# Altium schematic sheet 03 pmic.SchDoc
size A3; SheetNumber: 4; SheetTotal: 16
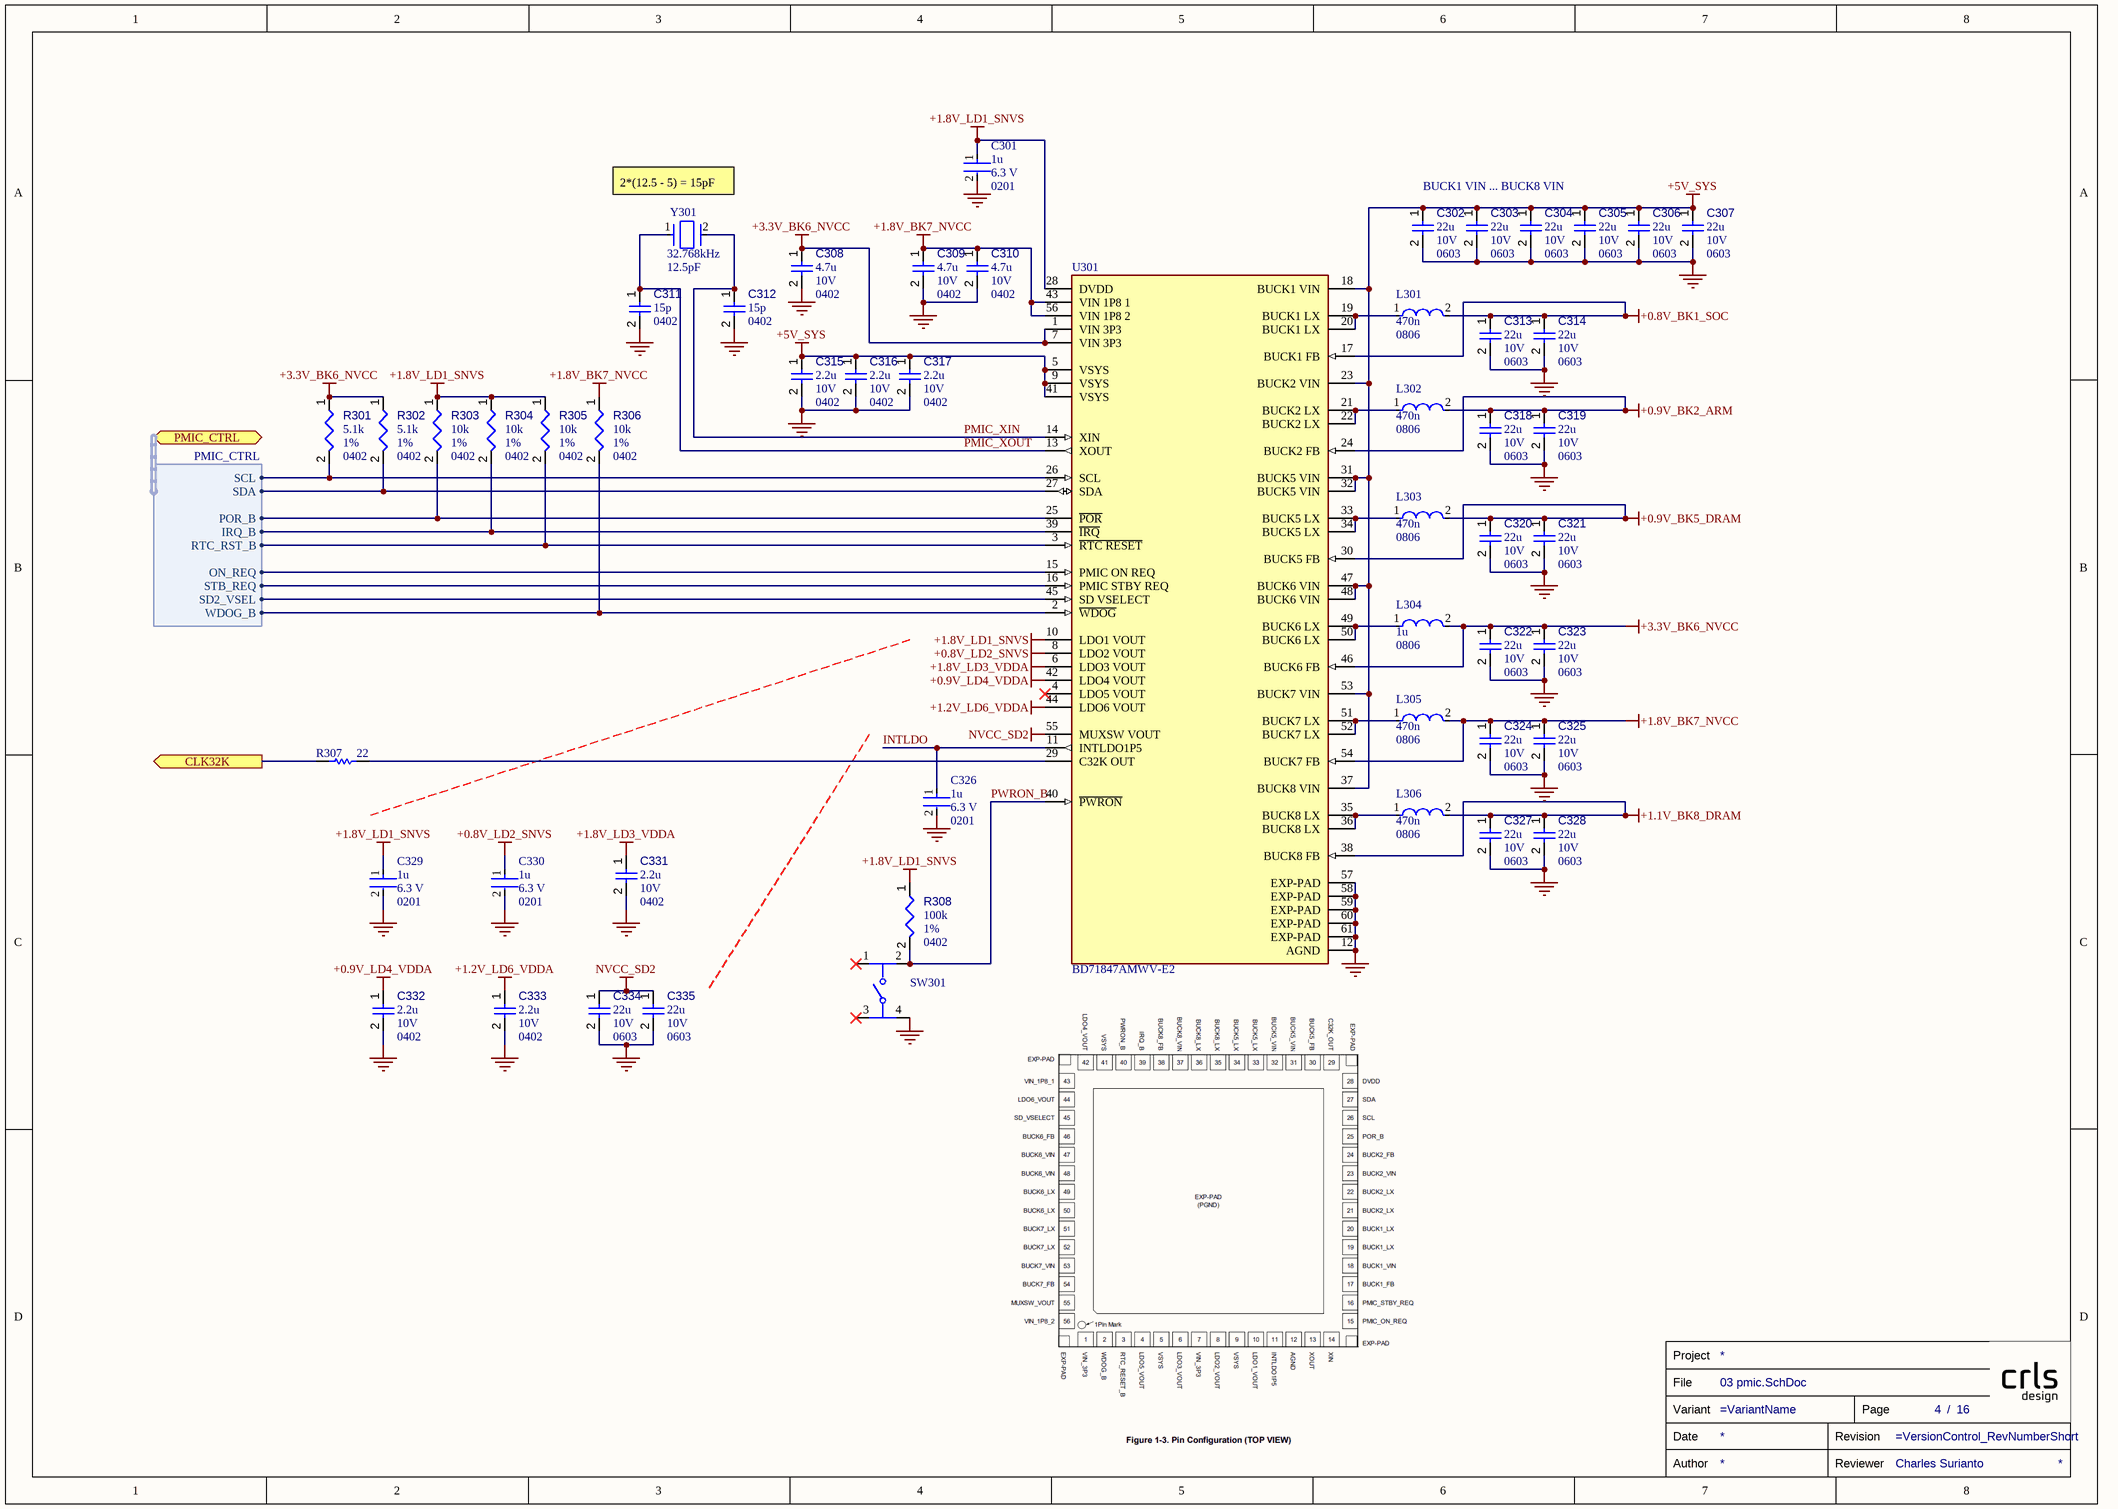
[diagram p0: 03 pmic.SchDoc]

## Parts
C301  Package: 0201  Capacitance: 1u  Voltage Rating: 6.3 V  [FP-CC0201-BA-MFG]  (hidden comment: CC0201MRX5R5BB105)
C302  value 22u  Case/Package: 0603  Voltage Rating: 10V  [CAPC0603(1608)100_L]  (hidden comment: Capacitors,0603,22u,10V)
C303  value 22u  Case/Package: 0603  Voltage Rating: 10V  [CAPC0603(1608)100_L]  (hidden comment: Capacitors,0603,22u,10V)
C304  value 22u  Case/Package: 0603  Voltage Rating: 10V  [CAPC0603(1608)100_L]  (hidden comment: Capacitors,0603,22u,10V)
C305  value 22u  Case/Package: 0603  Voltage Rating: 10V  [CAPC0603(1608)100_L]  (hidden comment: Capacitors,0603,22u,10V)
C306  value 22u  Case/Package: 0603  Voltage Rating: 10V  [CAPC0603(1608)100_L]  (hidden comment: Capacitors,0603,22u,10V)
C307  value 22u  Case/Package: 0603  Voltage Rating: 10V  [CAPC0603(1608)100_L]  (hidden comment: Capacitors,0603,22u,10V)
C308  value 4.7u  Case/Package: 0402  Voltage Rating: 10V  [CAPC0402(1005)60_L]  (hidden comment: Capacitors,0402,4.7u,10V)
C309  value 4.7u  Case/Package: 0402  Voltage Rating: 10V  [CAPC0402(1005)60_L]  (hidden comment: Capacitors,0402,4.7u,10V)
C310  value 4.7u  Case/Package: 0402  Voltage Rating: 10V  [CAPC0402(1005)60_L]  (hidden comment: Capacitors,0402,4.7u,10V)
C311  value 15p  Case/Package: 0402  [CAPC0402(1005)60_L]  (hidden comment: Capacitors,0402,15p)
C312  value 15p  Case/Package: 0402  [CAPC0402(1005)60_L]  (hidden comment: Capacitors,0402,15p)
C313  value 22u  Case/Package: 0603  Voltage Rating: 10V  [CAPC0603(1608)100_L]  (hidden comment: Capacitors,0603,22u,10V)
C314  value 22u  Case/Package: 0603  Voltage Rating: 10V  [CAPC0603(1608)100_L]  (hidden comment: Capacitors,0603,22u,10V)
C315  value 2.2u  Case/Package: 0402  Voltage Rating: 10V  [CAPC0402(1005)60_L]  (hidden comment: Capacitors,0402,2.2u,10V)
C316  value 2.2u  Case/Package: 0402  Voltage Rating: 10V  [CAPC0402(1005)60_L]  (hidden comment: Capacitors,0402,2.2u,10V)
C317  value 2.2u  Case/Package: 0402  Voltage Rating: 10V  [CAPC0402(1005)60_L]  (hidden comment: Capacitors,0402,2.2u,10V)
C318  value 22u  Case/Package: 0603  Voltage Rating: 10V  [CAPC0603(1608)100_L]  (hidden comment: Capacitors,0603,22u,10V)
C319  value 22u  Case/Package: 0603  Voltage Rating: 10V  [CAPC0603(1608)100_L]  (hidden comment: Capacitors,0603,22u,10V)
C320  value 22u  Case/Package: 0603  Voltage Rating: 10V  [CAPC0603(1608)100_L]  (hidden comment: Capacitors,0603,22u,10V)
C321  value 22u  Case/Package: 0603  Voltage Rating: 10V  [CAPC0603(1608)100_L]  (hidden comment: Capacitors,0603,22u,10V)
C322  value 22u  Case/Package: 0603  Voltage Rating: 10V  [CAPC0603(1608)100_L]  (hidden comment: Capacitors,0603,22u,10V)
C323  value 22u  Case/Package: 0603  Voltage Rating: 10V  [CAPC0603(1608)100_L]  (hidden comment: Capacitors,0603,22u,10V)
C324  value 22u  Case/Package: 0603  Voltage Rating: 10V  [CAPC0603(1608)100_L]  (hidden comment: Capacitors,0603,22u,10V)
C325  value 22u  Case/Package: 0603  Voltage Rating: 10V  [CAPC0603(1608)100_L]  (hidden comment: Capacitors,0603,22u,10V)
C326  Package: 0201  Capacitance: 1u  Voltage Rating: 6.3 V  [FP-CC0201-BA-MFG]  (hidden comment: CC0201MRX5R5BB105)
C327  value 22u  Case/Package: 0603  Voltage Rating: 10V  [CAPC0603(1608)100_L]  (hidden comment: Capacitors,0603,22u,10V)
C328  value 22u  Case/Package: 0603  Voltage Rating: 10V  [CAPC0603(1608)100_L]  (hidden comment: Capacitors,0603,22u,10V)
C329  Package: 0201  Capacitance: 1u  Voltage Rating: 6.3 V  [FP-CC0201-BA-MFG]  (hidden comment: CC0201MRX5R5BB105)
C330  Package: 0201  Capacitance: 1u  Voltage Rating: 6.3 V  [FP-CC0201-BA-MFG]  (hidden comment: CC0201MRX5R5BB105)
C331  value 2.2u  Case/Package: 0402  Voltage Rating: 10V  [CAPC0402(1005)60_L]  (hidden comment: Capacitors,0402,2.2u,10V)
C332  value 2.2u  Case/Package: 0402  Voltage Rating: 10V  [CAPC0402(1005)60_L]  (hidden comment: Capacitors,0402,2.2u,10V)
C333  value 2.2u  Case/Package: 0402  Voltage Rating: 10V  [CAPC0402(1005)60_L]  (hidden comment: Capacitors,0402,2.2u,10V)
C334  value 22u  Case/Package: 0603  Voltage Rating: 10V  [CAPC0603(1608)100_L]  (hidden comment: Capacitors,0603,22u,10V)
C335  value 22u  Case/Package: 0603  Voltage Rating: 10V  [CAPC0603(1608)100_L]  (hidden comment: Capacitors,0603,22u,10V)
L301  value 470n  Package: 0806  [FP-DFE201610C-MFG]  (hidden comment: DFE201610E-R47M=P2)
L302  value 470n  Package: 0806  [FP-DFE201610C-MFG]  (hidden comment: DFE201610E-R47M=P2)
L303  value 470n  Package: 0806  [FP-DFE201610C-MFG]  (hidden comment: DFE201610E-R47M=P2)
L304  value 1u  Package: 0806  [FP-DFE201612C-MFG]  (hidden comment: DFE201612E-1R0M=P2)
L305  value 470n  Package: 0806  [FP-DFE201610C-MFG]  (hidden comment: DFE201610E-R47M=P2)
L306  value 470n  Package: 0806  [FP-DFE201610C-MFG]  (hidden comment: DFE201610E-R47M=P2)
R301  value 5.1k  Case/Package: 0402  Tolerance: 1%  [RESC0402(1005)_L]  (hidden comment: Resistors,0402,1%,5.1k)
R302  value 5.1k  Case/Package: 0402  Tolerance: 1%  [RESC0402(1005)_L]  (hidden comment: Resistors,0402,1%,5.1k)
R303  value 10k  Case/Package: 0402  Tolerance: 1%  [RESC0402(1005)_L]  (hidden comment: Resistors,0402,1%,10k)
R304  value 10k  Case/Package: 0402  Tolerance: 1%  [RESC0402(1005)_L]  (hidden comment: Resistors,0402,1%,10k)
R305  value 10k  Case/Package: 0402  Tolerance: 1%  [RESC0402(1005)_L]  (hidden comment: Resistors,0402,1%,10k)
R306  value 10k  Case/Package: 0402  Tolerance: 1%  [RESC0402(1005)_L]  (hidden comment: Resistors,0402,1%,10k)
R307  value 22  [RESC0201(0603)_L]  (hidden comment: 22R 1% 0201(0603))
R308  value 100k  Case/Package: 0402  Tolerance: 1%  [RESC0402(1005)_L]  (hidden comment: Resistors,0402,1%,100k)
SW301  PTS810SJM250SMTRLFS  [FP-PTS810SJM250SMTRLFS-MFG]  (value not drawn)
TB?  Reviewer: Charles Surianto  (hidden comment: TITLE_BLOCK)  (graphical)
U301  BD71847AMWV-E2  [FP-UQFN56BV7070-MFG]
Y301  Frequency: 32.768kHz  Load Capacitance: 12.5pF  [FP-NX3215SA-MFG]  (hidden comment: Q13FC13500004)

## Ports
CLK32K (out), PMIC_CTRL (bidir, harness PMIC_CTRL)

## Harnesses
PMIC_CTRL: SCL, SDA, IRQ_B, POR_B, RTC_RST_B, ON_REQ, STB_REQ, SD2_VSEL, WDOG_B

## Nets
+0.8V_BK1_SOC: C313.1 C314.1 L301.2 U301.17(BUCK1_FB)
+0.8V_LD2_SNVS: C330.1 U301.8(LDO2_VOUT)
+0.9V_BK2_ARM: C318.1 C319.1 L302.2 U301.24(BUCK2_FB)
+0.9V_BK5_DRAM: C320.1 C321.1 L303.2 U301.30(BUCK5_FB)
+0.9V_LD4_VDDA: C332.1 U301.42(LDO4_VOUT)
+1.1V_BK8_DRAM: C327.1 C328.1 L306.2 U301.38(BUCK8_FB)
+1.2V_LD6_VDDA: C333.1 U301.44(LDO6_VOUT)
+1.8V_BK7_NVCC: C309.1 C310.1 C324.1 C325.1 L305.2 R306.1 U301.43(VIN_1P8_1) U301.54(BUCK7_FB) U301.56(VIN_1P8_2)
+1.8V_LD1_SNVS: C301.1 C329.1 R303.1 R304.1 R305.1 R308.1 U301.10(LDO1_VOUT) U301.28(DVDD)
+1.8V_LD3_VDDA: C331.1 U301.6(LDO3_VOUT)
+3.3V_BK6_NVCC: C308.1 C322.1 C323.1 L304.2 R301.1 R302.1 U301.1(VIN_3P3) U301.7(VIN_3P3) U301.46(BUCK6_FB)
+5V_SYS: C302.1 C303.1 C304.1 C305.1 C306.1 C307.1 C315.1 C316.1 C317.1 U301.5(VSYS) U301.9(VSYS) U301.18(BUCK1_VIN) U301.23(BUCK2_VIN) U301.31(BUCK5_VIN) U301.32(BUCK5_VIN) U301.37(BUCK8_VIN) U301.41(VSYS) U301.47(BUCK6_VIN) U301.48(BUCK6_VIN) U301.53(BUCK7_VIN)
GND: C301.2 C302.2 C303.2 C304.2 C305.2 C306.2 C307.2 C308.2 C309.2 C310.2 C311.2 C312.2 C313.2 C314.2 C315.2 C316.2 C317.2 C318.2 C319.2 C320.2 C321.2 C322.2 C323.2 C324.2 C325.2 C326.2 C327.2 C328.2 C329.2 C330.2 C331.2 C332.2 C333.2 C334.2 C335.2 SW301.4 U301.12(AGND) U301.57(EXP-PAD) U301.58(EXP-PAD) U301.59(EXP-PAD) U301.60(EXP-PAD) U301.61(EXP-PAD)
NVCC_SD2: C334.1 C335.1 U301.55(MUXSW_VOUT)
CLK32K: R307.1 ; port CLK32K
INTLDO: C326.1 U301.11(INTLDO1P5)
PMIC_XIN: C312.1 U301.14(XIN) Y301.2
PMIC_XOUT: C311.1 U301.13(XOUT) Y301.1
PWRON_B: R308.2 SW301.2 U301.40(~{PWRON})
NetL301_1: L301.1 U301.19(BUCK1_LX) U301.20(BUCK1_LX)
NetL302_1: L302.1 U301.21(BUCK2_LX) U301.22(BUCK2_LX)
NetL303_1: L303.1 U301.33(BUCK5_LX) U301.34(BUCK5_LX)
NetL304_1: L304.1 U301.49(BUCK6_LX) U301.50(BUCK6_LX)
NetL305_1: L305.1 U301.51(BUCK7_LX) U301.52(BUCK7_LX)
NetL306_1: L306.1 U301.35(BUCK8_LX) U301.36(BUCK8_LX)
NetR301_2: R301.2 U301.26(SCL) ; port PMIC_CTRL.SCL
NetR302_2: R302.2 U301.27(SDA) ; port PMIC_CTRL.SDA
NetR303_2: R303.2 U301.25(~{POR}) ; port PMIC_CTRL.POR_B
NetR304_2: R304.2 U301.39(~{IRQ}) ; port PMIC_CTRL.IRQ_B
NetR305_2: R305.2 U301.3(~{RTC_RESET}) ; port PMIC_CTRL.RTC_RST_B
NetR306_2: R306.2 U301.2(~{WDOG}) ; port PMIC_CTRL.WDOG_B
NetR307_2: R307.2 U301.29(C32K_OUT)
NetU301_15: U301.15(PMIC_ON_REQ) ; port PMIC_CTRL.ON_REQ
NetU301_16: U301.16(PMIC_STBY_REQ) ; port PMIC_CTRL.STB_REQ
NetU301_45: U301.45(SD_VSELECT) ; port PMIC_CTRL.SD2_VSEL

Not connected (* = marked no-connect by the designer): SW301 1* 3*; U301 4(LDO5_VOUT)*

## Notes on the sheet
- (near Y301) 2*(12.5 - 5) = 15pF
- BUCK1 VIN ... BUCK8 VIN
- (in symbol TITLE_BLOCK) Project; File; Variant; Page; /; Date; Revision; Author; Reviewer

## Library data of the parts
C301 C326 C329 C330 = CMP-03422-000660-2: CAP CER 1UF 6.3V X5R 0201; Manufacturer: Yageo; Tolerance: 0.2; Material: Ceramic; Temperature Coefficient: 15%; Category: Cap; Digikey Description: CAP CER 1UF 6.3V X5R 0201; Temperature: -55°C to +85°C; Temperature Range High: +85°C; ComponentLink2Description: Datasheet; Lead Free: Yes; Height: 0.33mm; Temperature Range Low: -55°C; Temperature Characteristic: X5R; Device Class L1: Passive Components; Footprint Url: http://www.yageo.com/exep/pages/download/literatures/UPY-C_GEN_24.pdf; Value: 1 uF; Octopart: https://octopart.com/cc0201mrx5r5bb105-yageo-33242268; Manufacturer Part Number: CC0201MRX5R5BB105; Automotive: No; Mouser Description: Multilayer Ceramic Capacitors MLCC - SMD/SMT 1.0uF 6.3V X5R 20%; Device Class L3: Ceramic Capacitors; ComponentLink2URL: http://www.yageo.com/documents/recent/UPY-GPHC_X5R_4V-to-50V_25.pdf; RoHS: TRUE; Ipc Land Pattern Name: CAPC6030X30; Device Class L2: Capacitors
C302-C325 C327 C328 C331-C335 = Capacitors: Capacitor; Component Type: Capacitors
L301-L303 L305 L306 = CMP-06042-011901-1: Shielded Wirewound Inductor 0.47uH 20% 3600mA 0.032Ω 0806 (2016)
L304 = CMP-06042-011635-1: Shielded Wirewound Inductor 1uH 20% 2900mA 0.048Ω 0806 (2016)
R301-R306 R308 = Resistors: Resistor; Component Type: Resistors
R307 = CMP-1010-00226-1: 22R 0.05W 1% 0201 (0603 Metric)  SMD; Case-EIA: 0201; Case-Metric: 0603; Technology: SMT; Power: 0.05 W; Tolerance: 1 %
SW301 = CMP-10040-000001-2: SWITCH TACTILE SPST-NO 0.05A 16V; Throw Configuration: SPST; Operating Force: 160gf; Actuator Type: Standard; Switch Travel: 0.15mm; Switch Function: Off-Mom; Max Current Rating: 50mA; Mechanical Life: 150000Cycles; Illumination Type: Non-Illuminated; Package Quantity: 2900; Depth: 4.6mm; Mount: Surface Mount; Packaging: Tape and Reel; Length: 3.2mm; RoHS Compliant: Yes; Case/Package: SMD/SMT; Voltage Rating (DC): 16V; Min Operating Temperature: -40°C; Termination: J-Bend; Lead Free: Lead Free; Contact Plating: Silver; Orientation: Straight; Max Operating Temperature: 85°C; Current Rating: 50mA; Color: Black
U301 = CMP-08930-000001-1: IC REG
Y301 = CMP-200220-000010-1: CRYSTAL 32.7680KHZ 12.5PF SMD; Frequency Tolerance: 20ppm; ESR (Equivalent Series Resistance): 70kR; Length: 0.126inch; Number of Pins: 2; Max Operating Temperature: 125°C; Width: 0.059inch; Case/Package: SMD/SMT; Height: 0.035inch; Packaging: Tape and Reel; Mount: Surface Mount; Package Quantity: 1000; Min Operating Temperature: -40°C
TB? = TITLE_BLOCK: Review Date: *